# Altium project BalanceCar.PrjPCB
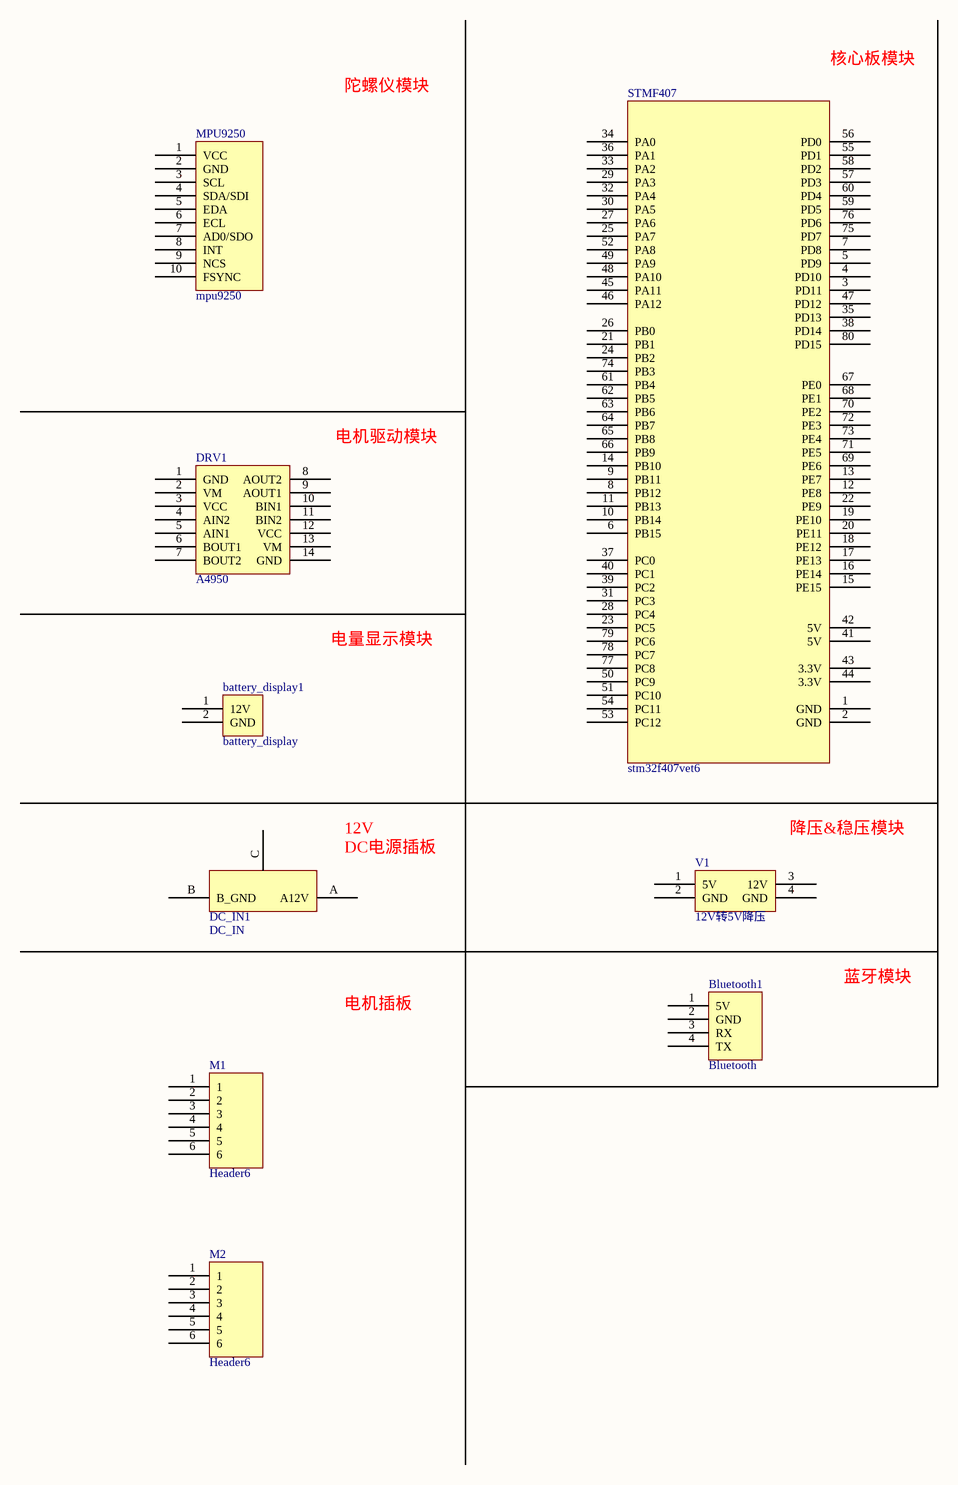
[diagram p0: BalanceCar.SchDoc]
1 sheet, 9 parts. Net scope: global (net labels, ports and power ports of the same name join across sheets).
Board file: BalanceCar.PcbDoc

## Sheet BalanceCar.SchDoc
size A3

### Parts
battery_display1  battery_display  [BatteryDisplay]
Bluetooth1  Bluetooth  [Bluetooth]
DC_IN1  DC_IN  [DC_IN]
DRV1  A4950  [A4950]
M1  Header6  [header6]
M2  Header6  [header6]
MPU9250  mpu9250  [mpu9250]
STMF407  stm32f407vet6  [stm32f407]
V1  12V转5V降压  [12V-5V]

### Nets

Not connected (* = marked no-connect by the designer): battery_display1 1(12V) 2(GND); Bluetooth1 1(5V) 2(GND) 3(RX) 4(TX); DC_IN1 A(A12V) B(B_GND) C; DRV1 1(GND) 2(VM) 3(VCC) 4(AIN2) 5(AIN1) 6(BOUT1) 7(BOUT2) 8(AOUT2) 9(AOUT1) 10(BIN1) 11(BIN2) 12(VCC) 13(VM) 14(GND); M1 1 2 3 4 5 6; M2 1 2 3 4 5 6; MPU9250 1(VCC) 2(GND) 3(SCL) 4(SDA/SDI) 5(EDA) 6(ECL) 7(AD0/SDO) 8(INT) 9(NCS) 10(FSYNC); STMF407 1(GND) 2(GND) 3(PD11) 4(PD10) 5(PD9) 6(PB15) 7(PD8) 8(PB12) 9(PB11) 10(PB14) 11(PB13) 12(PE8) 13(PE7) 14(PB10) 15(PE15) 16(PE14) 17(PE13) 18(PE12) 19(PE10) 20(PE11) 21(PB1) 22(PE9) 23(PC5) 24(PB2) 25(PA7) 26(PB0) 27(PA6) 28(PC4) 29(PA3) 30(PA5) 31(PC3) 32(PA4) 33(PA2) 34(PA0) 35(PD13) 36(PA1) 37(PC0) 38(PD14) 39(PC2) 40(PC1) 41(5V) 42(5V) 43(3.3V) 44(3.3V) 45(PA11) 46(PA12) 47(PD12) 48(PA10) 49(PA9) 50(PC9) 51(PC10) 52(PA8) 53(PC12) 54(PC11) 55(PD1) 56(PD0) 57(PD3) 58(PD2) 59(PD5) 60(PD4) 61(PB4) 62(PB5) 63(PB6) 64(PB7) 65(PB8) 66(PB9) 67(PE0) 68(PE1) 69(PE6) 70(PE2) 71(PE5) 72(PE3) 73(PE4) 74(PB3) 75(PD7) 76(PD6) 77(PC8) 78(PC7) 79(PC6) 80(PD15); V1 1(5V) 2(GND) 3(12V) 4(GND)

### Notes on the sheet
- 陀螺仪模块
- 核心板模块
- (near DRV1) 电机驱动模块
- 电量显示模块
- (near V1) 降压&稳压模块
- (near DC_IN1) 12V
  DC电源插板
- 电机插板
- 蓝牙模块

### Library data of the parts
DC_IN1 = DC插板
M1 M2 = 电机插板 6pin
STMF407 = stm32f407
V1 = 12V-5V